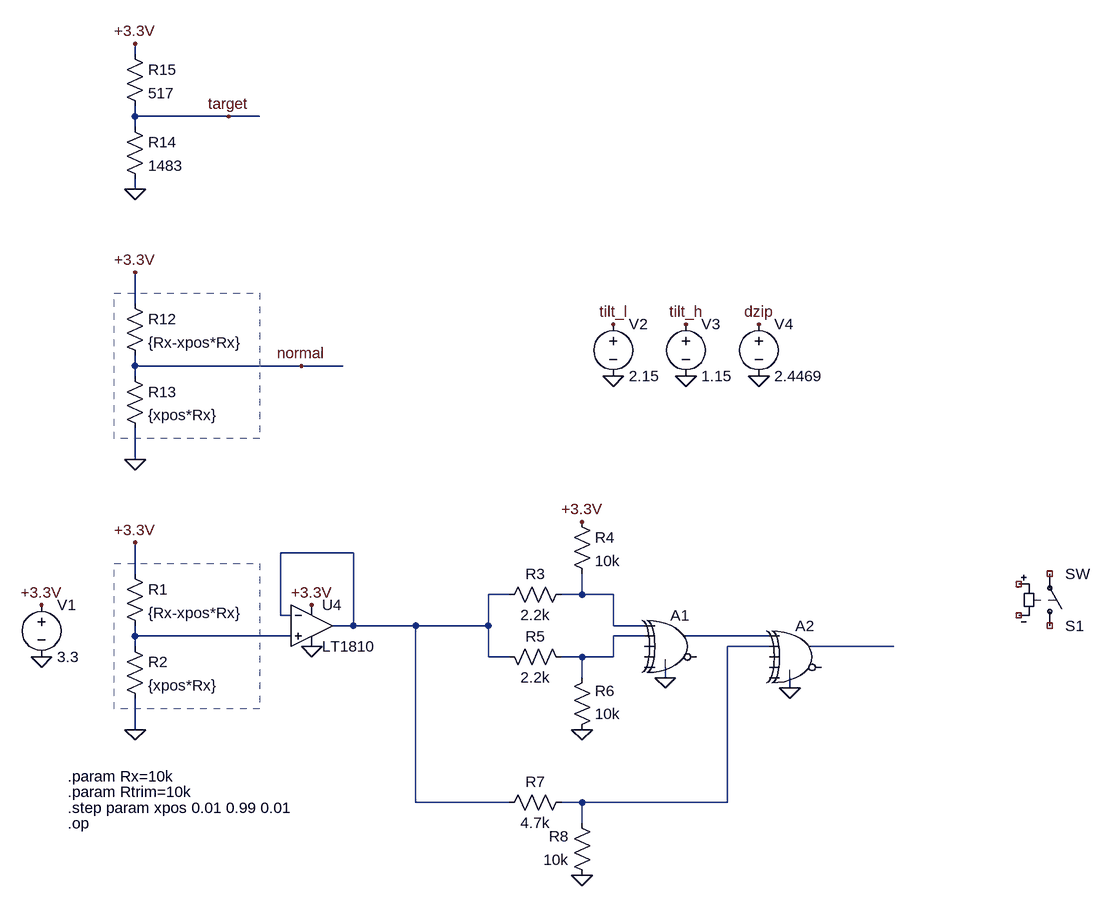
[diagram p0: schematic WalkMod2.asc]
WalkMod2.asc, the LTspice schematic file:
Version 4
SHEET 1 2244 880
WIRE 80 -736 80 -752
WIRE 80 -640 80 -656
WIRE 224 -640 80 -640
WIRE 272 -640 224 -640
WIRE 80 -624 80 -640
WIRE 80 -528 80 -544
WIRE 80 -352 80 -400
WIRE 80 -256 80 -272
WIRE 336 -256 80 -256
WIRE 400 -256 336 -256
WIRE 80 -240 80 -256
WIRE 80 -112 80 -160
WIRE 416 32 304 32
WIRE 80 64 80 16
WIRE 656 96 624 96
WIRE 768 96 768 64
WIRE 768 96 736 96
WIRE 816 96 768 96
WIRE 304 128 304 32
WIRE 320 128 304 128
WIRE 416 144 416 32
WIRE 416 144 384 144
WIRE 512 144 416 144
WIRE 624 144 624 96
WIRE 624 144 512 144
WIRE 816 144 816 96
WIRE 864 144 816 144
WIRE 80 160 80 144
WIRE 320 160 80 160
WIRE 864 160 816 160
WIRE 1056 160 928 160
WIRE 80 176 80 160
WIRE 1056 176 992 176
WIRE 1248 176 1120 176
WIRE 624 192 624 144
WIRE 656 192 624 192
WIRE 768 192 736 192
WIRE 816 192 816 160
WIRE 816 192 768 192
WIRE 768 224 768 192
WIRE 896 224 896 208
WIRE 1088 240 1088 224
WIRE 80 304 80 256
WIRE 512 416 512 144
WIRE 656 416 512 416
WIRE 768 416 736 416
WIRE 992 416 992 176
WIRE 992 416 768 416
WIRE 768 448 768 416
FLAG 80 304 0
FLAG 80 16 +3.3V
FLAG -64 192 0
FLAG -64 112 +3.3V
FLAG 80 -112 0
FLAG 80 -400 +3.3V
FLAG 336 -256 normal
FLAG 80 -528 0
FLAG 80 -752 +3.3V
FLAG 224 -640 target
FLAG 352 112 +3.3V
FLAG 352 176 0
FLAG 768 304 0
FLAG 768 -16 +3.3V
FLAG 896 224 0
FLAG 768 528 0
FLAG 1088 240 0
FLAG 816 -240 0
FLAG 928 -240 0
FLAG 1040 -240 0
FLAG 816 -320 tilt_l
FLAG 928 -320 tilt_h
FLAG 1040 -320 dzip
SYMBOL res 64 48 R0
SYMATTR InstName R1
SYMATTR Value {Rx-xpos*Rx}
SYMBOL res 64 160 R0
SYMATTR InstName R2
SYMATTR Value {xpos*Rx}
SYMBOL voltage -64 96 R0
WINDOW 123 0 0 Left 0
WINDOW 39 0 0 Left 0
SYMATTR InstName V1
SYMATTR Value 3.3
SYMBOL res 64 -368 R0
SYMATTR InstName R12
SYMATTR Value {Rx-xpos*Rx}
SYMBOL res 64 -256 R0
SYMATTR InstName R13
SYMATTR Value {xpos*Rx}
SYMBOL res 64 -640 R0
SYMATTR InstName R14
SYMATTR Value 1483
SYMBOL res 64 -752 R0
SYMATTR InstName R15
SYMATTR Value 517
SYMBOL Opamps\\LT1810 352 80 R0
SYMATTR InstName U4
SYMBOL Digital\\xor 912 112 R0
SYMATTR InstName A1
SYMATTR SpiceModel XOR(Vlow=0 Vhigh=3.3 Vt=1.65 Vh=0.66 Td=3n Trise=5n Tfall=5n)
SYMBOL res 752 80 R90
WINDOW 0 0 56 VBottom 2
WINDOW 3 32 56 VTop 2
SYMATTR InstName R3
SYMATTR Value 2.2k
SYMBOL res 752 -32 R0
SYMATTR InstName R4
SYMATTR Value 10k
SYMBOL res 752 208 M270
WINDOW 0 32 56 VTop 2
WINDOW 3 0 56 VBottom 2
SYMATTR InstName R5
SYMATTR Value 2.2k
SYMBOL res 752 320 M180
WINDOW 0 36 76 Left 2
WINDOW 3 36 40 Left 2
SYMATTR InstName R6
SYMATTR Value 10k
SYMBOL res 752 400 R90
WINDOW 0 0 56 VBottom 2
WINDOW 3 32 56 VTop 2
SYMATTR InstName R7
SYMATTR Value 4.7k
SYMBOL res 784 544 R180
WINDOW 0 36 76 Left 2
WINDOW 3 36 40 Left 2
SYMATTR InstName R8
SYMATTR Value 10k
SYMBOL Digital\\xor 1104 128 R0
SYMATTR InstName A2
SYMATTR SpiceModel XOR(Vlow=0 Vhigh=3.3 Vt=1.65 Vh=0.66 Td=3n Trise=5n Tfall=5n)
SYMBOL sw 1488 160 M180
SYMATTR InstName S1
SYMBOL voltage 816 -336 R0
WINDOW 123 0 0 Left 0
WINDOW 39 0 0 Left 0
SYMATTR InstName V2
SYMATTR Value 2.15
SYMBOL voltage 928 -336 R0
WINDOW 123 0 0 Left 0
WINDOW 39 0 0 Left 0
SYMATTR InstName V3
SYMATTR Value 1.15
SYMBOL voltage 1040 -336 R0
WINDOW 123 0 0 Left 0
WINDOW 39 0 0 Left 0
SYMATTR InstName V4
SYMATTR Value 2.4469
TEXT -24 376 Left 2 !.param Rx=10k
TEXT -24 424 Left 2 !.step param xpos 0.01 0.99 0.01
TEXT -24 448 Left 2 !.op
TEXT -24 400 Left 2 !.param Rtrim=10k
LINE Normal 48 272 48 48 2
LINE Normal 272 272 48 272 2
LINE Normal 272 48 272 272 2
LINE Normal 48 48 272 48 2
LINE Normal 48 -144 48 -368 2
LINE Normal 272 -144 48 -144 2
LINE Normal 272 -368 272 -144 2
LINE Normal 48 -368 272 -368 2

The netlist it stands for:
* WalkMod2.asc
R1 +3.3V N003 {Rx-xpos*Rx}
R2 N003 0 {xpos*Rx}
V1 +3.3V 0 3.3
R12 +3.3V normal {Rx-xpos*Rx}
R13 normal 0 {xpos*Rx}
R14 target 0 1483
R15 +3.3V target 517
XU4 N003 N001 +3.3V 0 N001 LT1810  ; pins In+ In- V+ V- OUT
A1 N002 N004 0 0 0 0 N005 0 XOR(Vlow=0 Vhigh=3.3 Vt=1.65 Vh=0.66 Td=3n Trise=5n Tfall=5n)
R3 N002 N001 2.2k
R4 +3.3V N002 10k
R5 N004 N001 2.2k
R6 0 N004 10k
R7 N006 N001 4.7k
R8 0 N006 10k
A2 N005 N006 0 0 0 0 N007 0 XOR(Vlow=0 Vhigh=3.3 Vt=1.65 Vh=0.66 Td=3n Trise=5n Tfall=5n)
S1 NC_01 NC_02 NC_03 NC_04 SW
V2 tilt_l 0 2.15
V3 tilt_h 0 1.15
V4 dzip 0 2.4469
.param Rx=10k
.step param xpos 0.01 0.99 0.01
.op
.param Rtrim=10k
.backanno
.end